# EAGLE design trig2_board (EAGLE 9.2.0)
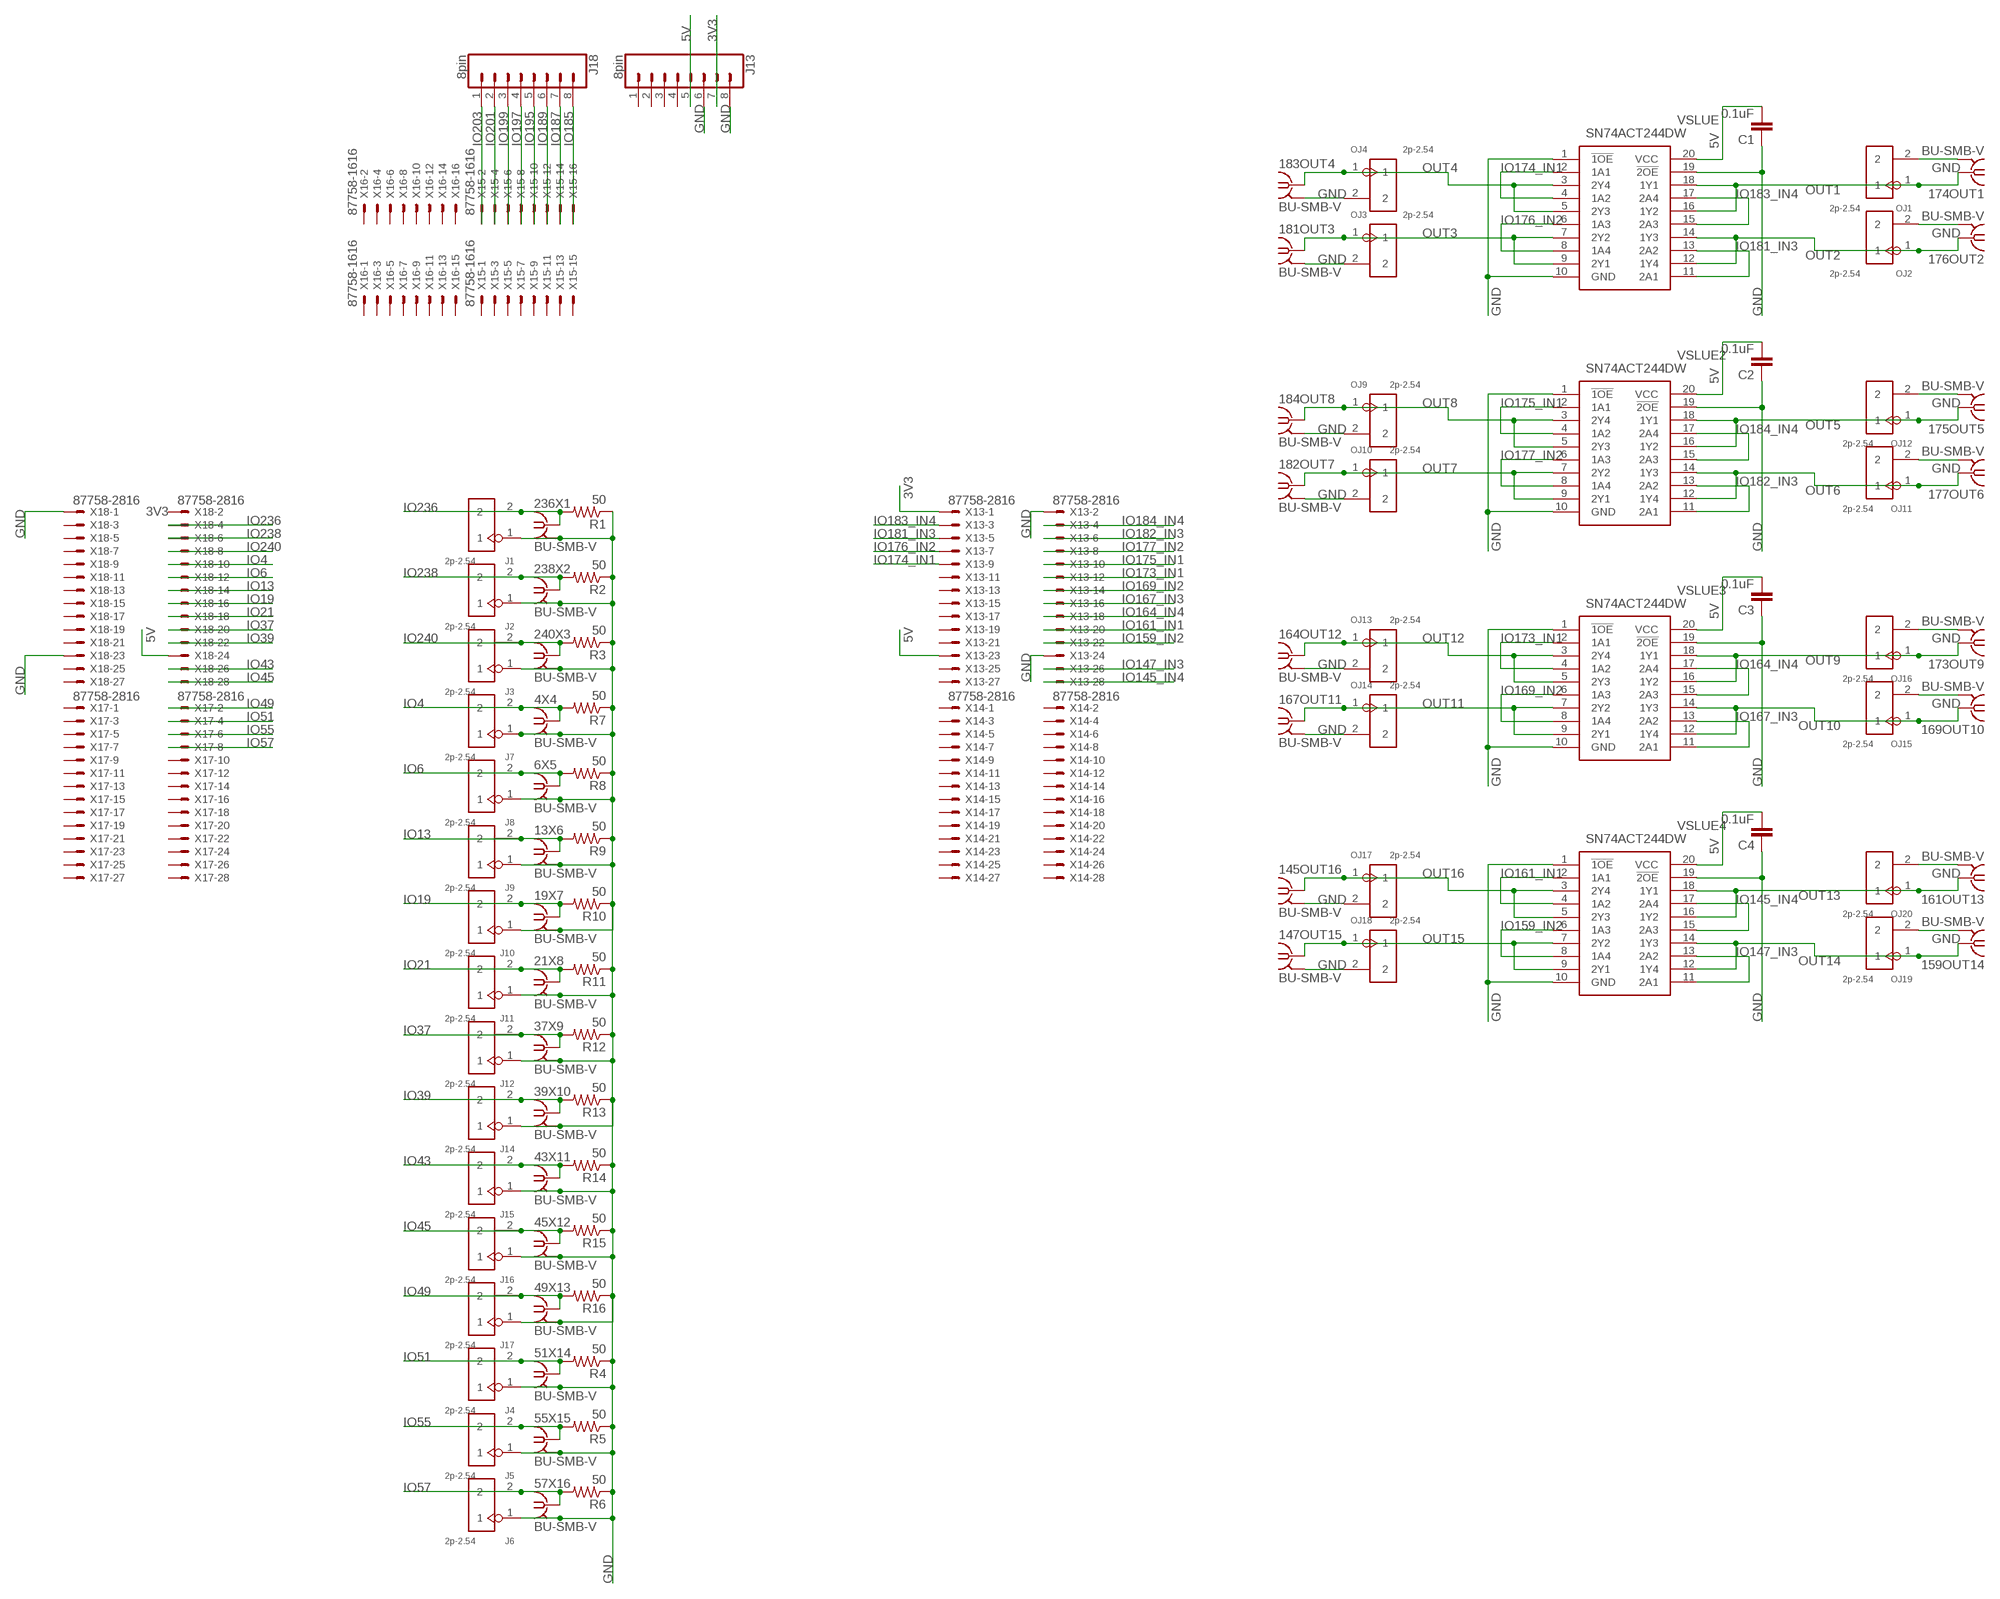
[diagram p0: schematic, sheet 1]

## Parts
4X4  BU-SMB-V  [BU-SMB-V]
6X5  BU-SMB-V  [BU-SMB-V]
13X6  BU-SMB-V  [BU-SMB-V]
19X7  BU-SMB-V  [BU-SMB-V]
21X8  BU-SMB-V  [BU-SMB-V]
37X9  BU-SMB-V  [BU-SMB-V]
39X10  BU-SMB-V  [BU-SMB-V]
43X11  BU-SMB-V  [BU-SMB-V]
45X12  BU-SMB-V  [BU-SMB-V]
49X13  BU-SMB-V  [BU-SMB-V]
51X14  BU-SMB-V  [BU-SMB-V]
55X15  BU-SMB-V  [BU-SMB-V]
57X16  BU-SMB-V  [BU-SMB-V]
145OUT16  BU-SMB-V  [BU-SMB-V]
147OUT15  BU-SMB-V  [BU-SMB-V]
159OUT14  BU-SMB-V  [BU-SMB-V]
161OUT13  BU-SMB-V  [BU-SMB-V]
164OUT12  BU-SMB-V  [BU-SMB-V]
167OUT11  BU-SMB-V  [BU-SMB-V]
169OUT10  BU-SMB-V  [BU-SMB-V]
173OUT9  BU-SMB-V  [BU-SMB-V]
174OUT1  BU-SMB-V  [BU-SMB-V]
175OUT5  BU-SMB-V  [BU-SMB-V]
176OUT2  BU-SMB-V  [BU-SMB-V]
177OUT6  BU-SMB-V  [BU-SMB-V]
181OUT3  BU-SMB-V  [BU-SMB-V]
182OUT7  BU-SMB-V  [BU-SMB-V]
183OUT4  BU-SMB-V  [BU-SMB-V]
184OUT8  BU-SMB-V  [BU-SMB-V]
236X1  BU-SMB-V  [BU-SMB-V]
238X2  BU-SMB-V  [BU-SMB-V]
240X3  BU-SMB-V  [BU-SMB-V]
C1  0.1uF  CAP0805  [0805]
C2  0.1uF  CAP0805  [0805]
C3  0.1uF  CAP0805  [0805]
C4  0.1uF  CAP0805  [0805]
J1  2p-2.54  DIP-BLACK-MALE-HEADER-VERT(2P-2.54)  [H2-2.54]
J2  2p-2.54  DIP-BLACK-MALE-HEADER-VERT(2P-2.54)  [H2-2.54]
J3  2p-2.54  DIP-BLACK-MALE-HEADER-VERT(2P-2.54)  [H2-2.54]
J4  2p-2.54  DIP-BLACK-MALE-HEADER-VERT(2P-2.54)  [H2-2.54]
J5  2p-2.54  DIP-BLACK-MALE-HEADER-VERT(2P-2.54)  [H2-2.54]
J6  2p-2.54  DIP-BLACK-MALE-HEADER-VERT(2P-2.54)  [H2-2.54]
J7  2p-2.54  DIP-BLACK-MALE-HEADER-VERT(2P-2.54)  [H2-2.54]
J8  2p-2.54  DIP-BLACK-MALE-HEADER-VERT(2P-2.54)  [H2-2.54]
J9  2p-2.54  DIP-BLACK-MALE-HEADER-VERT(2P-2.54)  [H2-2.54]
J10  2p-2.54  DIP-BLACK-MALE-HEADER-VERT(2P-2.54)  [H2-2.54]
J11  2p-2.54  DIP-BLACK-MALE-HEADER-VERT(2P-2.54)  [H2-2.54]
J12  2p-2.54  DIP-BLACK-MALE-HEADER-VERT(2P-2.54)  [H2-2.54]
J13  8pin  CONN_08"  [1X08]
J14  2p-2.54  DIP-BLACK-MALE-HEADER-VERT(2P-2.54)  [H2-2.54]
J15  2p-2.54  DIP-BLACK-MALE-HEADER-VERT(2P-2.54)  [H2-2.54]
J16  2p-2.54  DIP-BLACK-MALE-HEADER-VERT(2P-2.54)  [H2-2.54]
J17  2p-2.54  DIP-BLACK-MALE-HEADER-VERT(2P-2.54)  [H2-2.54]
J18  8pin  CONN_08"  [1X08]
OJ1  2p-2.54  DIP-BLACK-MALE-HEADER-VERT(2P-2.54)  [H2-2.54]
OJ2  2p-2.54  DIP-BLACK-MALE-HEADER-VERT(2P-2.54)  [H2-2.54]
OJ3  2p-2.54  DIP-BLACK-MALE-HEADER-VERT(2P-2.54)  [H2-2.54]
OJ4  2p-2.54  DIP-BLACK-MALE-HEADER-VERT(2P-2.54)  [H2-2.54]
OJ9  2p-2.54  DIP-BLACK-MALE-HEADER-VERT(2P-2.54)  [H2-2.54]
OJ10  2p-2.54  DIP-BLACK-MALE-HEADER-VERT(2P-2.54)  [H2-2.54]
OJ11  2p-2.54  DIP-BLACK-MALE-HEADER-VERT(2P-2.54)  [H2-2.54]
OJ12  2p-2.54  DIP-BLACK-MALE-HEADER-VERT(2P-2.54)  [H2-2.54]
OJ13  2p-2.54  DIP-BLACK-MALE-HEADER-VERT(2P-2.54)  [H2-2.54]
OJ14  2p-2.54  DIP-BLACK-MALE-HEADER-VERT(2P-2.54)  [H2-2.54]
OJ15  2p-2.54  DIP-BLACK-MALE-HEADER-VERT(2P-2.54)  [H2-2.54]
OJ16  2p-2.54  DIP-BLACK-MALE-HEADER-VERT(2P-2.54)  [H2-2.54]
OJ17  2p-2.54  DIP-BLACK-MALE-HEADER-VERT(2P-2.54)  [H2-2.54]
OJ18  2p-2.54  DIP-BLACK-MALE-HEADER-VERT(2P-2.54)  [H2-2.54]
OJ19  2p-2.54  DIP-BLACK-MALE-HEADER-VERT(2P-2.54)  [H2-2.54]
OJ20  2p-2.54  DIP-BLACK-MALE-HEADER-VERT(2P-2.54)  [H2-2.54]
R1  50  RESISTORAXIAL-0.3  [AXIAL-0.3]
R2  50  RESISTORAXIAL-0.3  [AXIAL-0.3]
R3  50  RESISTORAXIAL-0.3  [AXIAL-0.3]
R4  50  RESISTORAXIAL-0.3  [AXIAL-0.3]
R5  50  RESISTORAXIAL-0.3  [AXIAL-0.3]
R6  50  RESISTORAXIAL-0.3  [AXIAL-0.3]
R7  50  RESISTORAXIAL-0.3  [AXIAL-0.3]
R8  50  RESISTORAXIAL-0.3  [AXIAL-0.3]
R9  50  RESISTORAXIAL-0.3  [AXIAL-0.3]
R10  50  RESISTORAXIAL-0.3  [AXIAL-0.3]
R11  50  RESISTORAXIAL-0.3  [AXIAL-0.3]
R12  50  RESISTORAXIAL-0.3  [AXIAL-0.3]
R13  50  RESISTORAXIAL-0.3  [AXIAL-0.3]
R14  50  RESISTORAXIAL-0.3  [AXIAL-0.3]
R15  50  RESISTORAXIAL-0.3  [AXIAL-0.3]
R16  50  RESISTORAXIAL-0.3  [AXIAL-0.3]
VSLUE  SN74ACT244DW  [SOIC127P1030X265-20N]
VSLUE2  SN74ACT244DW  [SOIC127P1030X265-20N]
VSLUE3  SN74ACT244DW  [SOIC127P1030X265-20N]
VSLUE4  SN74ACT244DW  [SOIC127P1030X265-20N]
X13  87758-2816  [87758-2816]
X14  87758-2816  [87758-2816]
X15  87758-1616  [87758-1616]
X16  87758-1616  [87758-1616]
X17  87758-2816  [87758-2816]
X18  87758-2816  [87758-2816]

## Nets
3V3 [power]: J13.7 X13.1
5V [power]: C1.2 C2.2 C3.2 C4.2 J13.5 VSLUE2.20(VCC) VSLUE3.20(VCC) VSLUE4.20(VCC) VSLUE.20(VCC) X13.23 X18.24
GND: 4X4.2 4X4.3 4X4.4 4X4.5 6X5.2 6X5.3 6X5.4 6X5.5 13X6.2 13X6.3 13X6.4 13X6.5 19X7.2 19X7.3 19X7.4 19X7.5 21X8.2 21X8.3 21X8.4 21X8.5 37X9.2 37X9.3 37X9.4 37X9.5 39X10.2 39X10.3 39X10.4 39X10.5 43X11.2 43X11.3 43X11.4 43X11.5 45X12.2 45X12.3 45X12.4 45X12.5 49X13.2 49X13.3 49X13.4 49X13.5 51X14.2 51X14.3 51X14.4 51X14.5 55X15.2 55X15.3 55X15.4 55X15.5 57X16.2 57X16.3 57X16.4 57X16.5 145OUT16.2 145OUT16.3 145OUT16.4 145OUT16.5 147OUT15.2 147OUT15.3 147OUT15.4 147OUT15.5 159OUT14.2 159OUT14.3 159OUT14.4 159OUT14.5 161OUT13.2 161OUT13.3 161OUT13.4 161OUT13.5 164OUT12.2 164OUT12.3 164OUT12.4 164OUT12.5 167OUT11.2 167OUT11.3 167OUT11.4 167OUT11.5 169OUT10.2 169OUT10.3 169OUT10.4 169OUT10.5 173OUT9.2 173OUT9.3 173OUT9.4 173OUT9.5 174OUT1.2 174OUT1.3 174OUT1.4 174OUT1.5 175OUT5.2 175OUT5.3 175OUT5.4 175OUT5.5 176OUT2.2 176OUT2.3 176OUT2.4 176OUT2.5 177OUT6.2 177OUT6.3 177OUT6.4 177OUT6.5 181OUT3.2 181OUT3.3 181OUT3.4 181OUT3.5 182OUT7.2 182OUT7.3 182OUT7.4 182OUT7.5 183OUT4.2 183OUT4.3 183OUT4.4 183OUT4.5 184OUT8.2 184OUT8.3 184OUT8.4 184OUT8.5 236X1.2 236X1.3 236X1.4 236X1.5 238X2.2 238X2.3 238X2.4 238X2.5 240X3.2 240X3.3 240X3.4 240X3.5 C1.1 C2.1 C3.1 C4.1 J1.1 J2.1 J3.1 J4.1 J5.1 J6.1 J7.1 J8.1 J9.1 J10.1 J11.1 J12.1 J13.6 J13.8 J14.1 J15.1 J16.1 J17.1 OJ1.2 OJ2.2 OJ3.2 OJ4.2 OJ9.2 OJ10.2 OJ11.2 OJ12.2 OJ13.2 OJ14.2 OJ15.2 OJ16.2 OJ17.2 OJ18.2 OJ19.2 OJ20.2 R1.P$1 R2.P$1 R3.P$1 R4.P$1 R5.P$1 R6.P$1 R7.P$1 R8.P$1 R9.P$1 R10.P$1 R11.P$1 R12.P$1 R13.P$1 R14.P$1 R15.P$1 R16.P$1 VSLUE2.1(!1OE) VSLUE2.10(GND) VSLUE2.19(!2OE) VSLUE3.1(!1OE) VSLUE3.10(GND) VSLUE3.19(!2OE) VSLUE4.1(!1OE) VSLUE4.10(GND) VSLUE4.19(!2OE) VSLUE.1(!1OE) VSLUE.10(GND) VSLUE.19(!2OE) X13.2 X13.24 X18.1 X18.23
IO4: 4X4.1 J7.2 R7.P$2 X18.10
IO6: 6X5.1 J8.2 R8.P$2 X18.12
IO13: 13X6.1 J9.2 R9.P$2 X18.14
IO19: 19X7.1 J10.2 R10.P$2 X18.16
IO21: 21X8.1 J11.2 R11.P$2 X18.18
IO37: 37X9.1 J12.2 R12.P$2 X18.20
IO39: 39X10.1 J14.2 R13.P$2 X18.22
IO43: 43X11.1 J15.2 R14.P$2 X18.26
IO45: 45X12.1 J16.2 R15.P$2 X18.28
IO49: 49X13.1 J17.2 R16.P$2 X17.2
IO51: 51X14.1 J4.2 R4.P$2 X17.4
IO55: 55X15.1 J5.2 R5.P$2 X17.6
IO57: 57X16.1 J6.2 R6.P$2 X17.8
IO145_IN4: VSLUE4.15(2A3) VSLUE4.17(2A4) X13.28
IO147_IN3: VSLUE4.11(2A1) VSLUE4.13(2A2) X13.26
IO159_IN2: VSLUE4.6(1A3) VSLUE4.8(1A4) X13.22
IO161_IN1: VSLUE4.2(1A1) VSLUE4.4(1A2) X13.20
IO164_IN4: VSLUE3.15(2A3) VSLUE3.17(2A4) X13.18
IO167_IN3: VSLUE3.11(2A1) VSLUE3.13(2A2) X13.16
IO169_IN2: VSLUE3.6(1A3) VSLUE3.8(1A4) X13.14
IO173_IN1: VSLUE3.2(1A1) VSLUE3.4(1A2) X13.12
IO174_IN1: VSLUE.2(1A1) VSLUE.4(1A2) X13.9
IO175_IN1: VSLUE2.2(1A1) VSLUE2.4(1A2) X13.10
IO176_IN2: VSLUE.6(1A3) VSLUE.8(1A4) X13.7
IO177_IN2: VSLUE2.6(1A3) VSLUE2.8(1A4) X13.8
IO181_IN3: VSLUE.11(2A1) VSLUE.13(2A2) X13.5
IO182_IN3: VSLUE2.11(2A1) VSLUE2.13(2A2) X13.6
IO183_IN4: VSLUE.15(2A3) VSLUE.17(2A4) X13.3
IO184_IN4: VSLUE2.15(2A3) VSLUE2.17(2A4) X13.4
IO185: J18.8 X15.16
IO187: J18.7 X15.14
IO189: J18.6 X15.12
IO195: J18.5 X15.10
IO197: J18.4 X15.8
IO199: J18.3 X15.6
IO201: J18.2 X15.4
IO203: J18.1 X15.2
IO236: 236X1.1 J1.2 R1.P$2 X18.4
IO238: 238X2.1 J2.2 R2.P$2 X18.6
IO240: 240X3.1 J3.2 R3.P$2 X18.8
OUT1: 174OUT1.1 OJ1.1 VSLUE.16(1Y2) VSLUE.18(1Y1)
OUT2: 176OUT2.1 OJ2.1 VSLUE.12(1Y4) VSLUE.14(1Y3)
OUT3: 181OUT3.1 OJ3.1 VSLUE.7(2Y2) VSLUE.9(2Y1)
OUT4: 183OUT4.1 OJ4.1 VSLUE.3(2Y4) VSLUE.5(2Y3)
OUT5: 175OUT5.1 OJ12.1 VSLUE2.16(1Y2) VSLUE2.18(1Y1)
OUT6: 177OUT6.1 OJ11.1 VSLUE2.12(1Y4) VSLUE2.14(1Y3)
OUT7: 182OUT7.1 OJ10.1 VSLUE2.7(2Y2) VSLUE2.9(2Y1)
OUT8: 184OUT8.1 OJ9.1 VSLUE2.3(2Y4) VSLUE2.5(2Y3)
OUT9: 173OUT9.1 OJ16.1 VSLUE3.16(1Y2) VSLUE3.18(1Y1)
OUT10: 169OUT10.1 OJ15.1 VSLUE3.12(1Y4) VSLUE3.14(1Y3)
OUT11: 167OUT11.1 OJ14.1 VSLUE3.7(2Y2) VSLUE3.9(2Y1)
OUT12: 164OUT12.1 OJ13.1 VSLUE3.3(2Y4) VSLUE3.5(2Y3)
OUT13: 161OUT13.1 OJ20.1 VSLUE4.16(1Y2) VSLUE4.18(1Y1)
OUT14: 159OUT14.1 OJ19.1 VSLUE4.12(1Y4) VSLUE4.14(1Y3)
OUT15: 147OUT15.1 OJ18.1 VSLUE4.7(2Y2) VSLUE4.9(2Y1)
OUT16: 145OUT16.1 OJ17.1 VSLUE4.3(2Y4) VSLUE4.5(2Y3)
Unconnected: J13.1 J13.2 J13.3 J13.4 X13.11 X13.13 X13.15 X13.17 X13.19 X13.21 X13.25 X13.27 X14.1 X14.2 X14.3 X14.4 X14.5 X14.6 X14.7 X14.8 X14.9 X14.10 X14.11 X14.12 X14.13 X14.14 X14.15 X14.16 X14.17 X14.18 X14.19 X14.20 X14.21 X14.22 X14.23 X14.24 X14.25 X14.26 X14.27 X14.28 X15.1 X15.3 X15.5 X15.7 X15.9 X15.11 X15.13 X15.15 X16.1 X16.2 X16.3 X16.4 X16.5 X16.6 X16.7 X16.8 X16.9 X16.10 X16.11 X16.12 X16.13 X16.14 X16.15 X16.16 X17.1 X17.3 X17.5 X17.7 X17.9 X17.10 X17.11 X17.12 X17.13 X17.14 X17.15 X17.16 X17.17 X17.18 X17.19 X17.20 X17.21 X17.22 X17.23 X17.24 X17.25 X17.26 X17.27 X17.28 X18.2 X18.3 X18.5 X18.7 X18.9 X18.11 X18.13 X18.15 X18.17 X18.19 X18.21 X18.25 X18.27

## Notes on the sheet
- 3V3

## Library data of the parts
4X4 6X5 13X6 19X7 21X8 37X9 39X10 43X11 45X12 49X13 51X14 55X15 57X16 145OUT16 147OUT15 159OUT14 161OUT13 164OUT12 167OUT11 169OUT10 173OUT9 174OUT1 175OUT5 176OUT2 177OUT6 181OUT3 182OUT7 183OUT4 184OUT8 236X1 238X2 240X3 = con-coax:BU-SMB-V: FEMALE SMB CONNECTOR Radiall distributor RS 112-2993; OC_FARNELL: unknown; OC_NEWARK: unknown
C1-C4 = SparkFun-Capacitors:CAP: Capacitor Standard 0603 ceramic capacitor, and 0.1" leaded capacitor.
J1-J12 J14-J17 OJ1-OJ4 OJ9-OJ20 = Seeed-Connector:DIP-BLACK-MALE-HEADER-VERT(2P-2.54): 320020016; MPN: P125-1102A0BS116A1
J13 J18 = SparkFun-Connectors:CONN_08: Multi connection point. Often used as Generic Header-pin footprint for 0.1 inch spaced/style header connections On any of the 0.1 inch spaced packages, you can populate with these: Break Away Headers - Straight <https://www.sparkfun.com/products/116> (PRT-00116) Break Away Male Headers - Right Angle <https://www.sparkfun.com/products/553> (PRT-00553) Female Headers <https://www.sparkfun.com/products/115> (PRT-00115) Break Away Headers - Machine Pin <https://www.sparkfun.com/products/117> (PRT-00117) Break Away Female Headers - Swiss Machine Pin <https://www.sparkfun.com/products/743> (PRT-00743) Arduino Stackable Header - 8 Pin <https://www.sparkfun.com/products/9279> (PRT-09279) For SCREWTERMINALS and SPRING TERMINALS visit here: Screw Terimnals on SparkFun.com <https://www.sparkfun.com/search/results?term=Screw+Terminals> (5mm/3.5mm/2.54mm spacing) This device is also useful as a general connection point to wire up your design to another part of your project. Our various solder wires solder well into these plated through hole pads. Hook-Up Wire - Assortment (Stranded, 22 AWG) <https://www.sparkfun.com/products/11375> (PRT-11375) Hook-Up Wire - Assortment (Solid Core, 22 AWG) <https://www.sparkfun.com/products/11367> (PRT-11367) View the entire wire category on our website here <https://www.sparkfun.com/categories/141> Special notes: Molex polarized connector foot print use with SKU : PRT-08231 with associated crimp pins and housings. 1MM SMD Version SKU: PRT-10208 NOTES ON THE VARIANTS LOCK and LOCK_LONGPADS... This footprint was designed to help hold the alignment of a through-hole component (i.e. 6-pin header) while soldering it into place. You may notice that each hole has been shifted either up or down by 0.005 of an inch from it's more standard position (which is a perfectly straight line). This slight alteration caused the pins (the squares in the middle) to touch the edges of the holes. Because they are alternating, it causes a "brace" to hold the component in place. 0.005 has proven to be the perfect amount of "off-center" position when using our standard breakaway headers. Although looks a little odd when you look at the bare footprint, once you have a header in there, the alteration is very hard to notice. Also,if you push a header all the way into place, it is covered up entirely on the bottom side.; PROD_ID: CONN-08438
R1-R16 = SparkFun-Passives:RESISTOR: Resistor Basic schematic elements and footprints for 0603, 1206, and PTH resistors.
VSLUE VSLUE2-VSLUE4 = SN74ACT244DW:SN74ACT244DW: SN74ACT244DW, 8-Bit Buffer, Line Driver, ACT, 3-State Non-Inverting 4.5 5.5 V 20-Pin SOIC Source: Datasheet <http://www.ti.com/lit/ds/symlink/sn74act244.pdf>; ARROW_PART_NUMBER: SN74ACT244DW; ARROW_PRICE-STOCK: https://www.arrow.com/en/products/sn74act244dw/texas-instruments; DESCRIPTION: SN74ACT244DW, 8-Bit Buffer, Line Driver, ACT, 3-State Non-Inverting 4.5 5.5 V 20-Pin SOIC; HEIGHT: 2.65mm; MANUFACTURER_NAME: Texas Instruments; MANUFACTURER_PART_NUMBER: SN74ACT244DW; RS_PART_NUMBER: 4363169; RS_PRICE-STOCK: http://uk.rs-online.com/web/p/products/4363169
X13 X14 X17 X18 = con-molex:87758-2816: 28 Pin - 2mm Dual Row Single Wafer, Vertical T/H HDR Source: http://www.molex.com/pdm_docs/sd/877580616_sd.pdf; MF: MOLEX; MPN: 87758-2816; OC_FARNELL: unknown; OC_NEWARK: 25M5681
X15 X16 = con-molex:87758-1616: 16 Pin - 2mm Dual Row Single Wafer, Vertical T/H HDR Source: http://www.molex.com/pdm_docs/sd/877580616_sd.pdf; MF: MOLEX; MPN: 87758-1616; OC_FARNELL: 7472366; OC_NEWARK: 59J1563

## Net classes
0 default: width 0.254 mm
1 power: width 0.762 mm

## Board
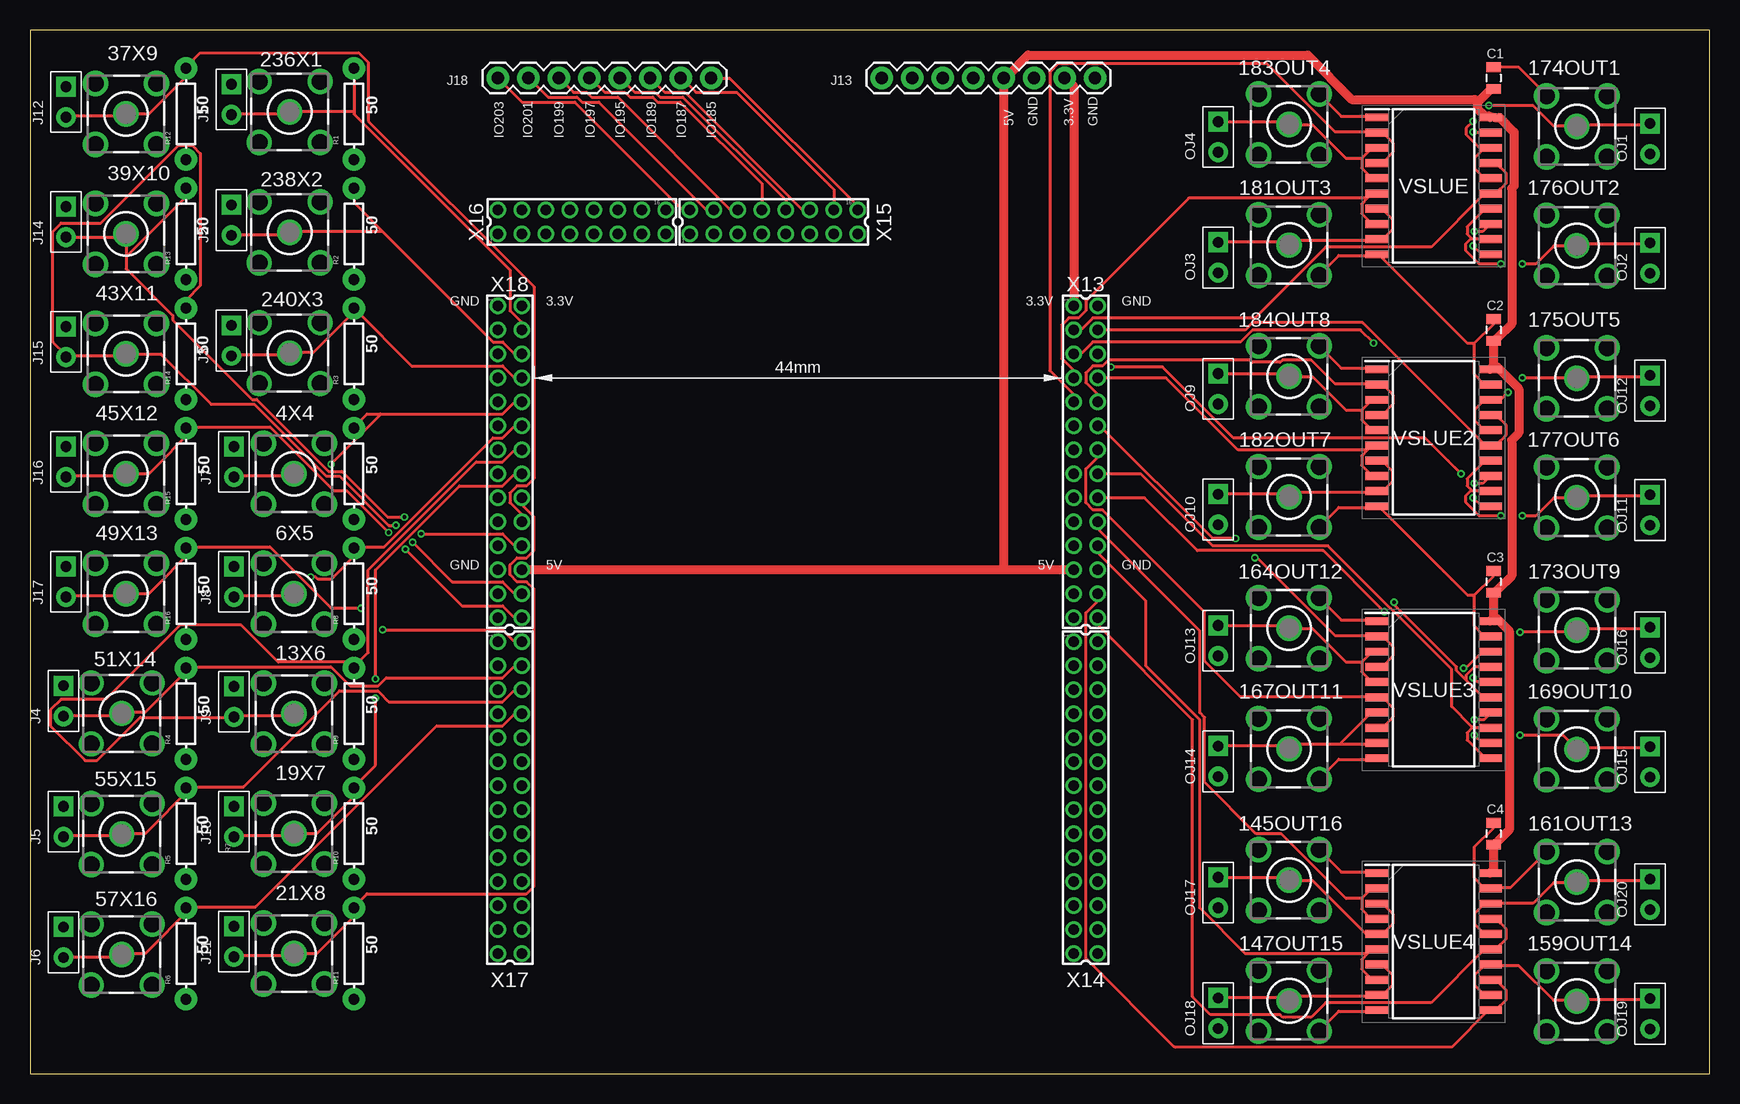
[diagram p1: board, top side]
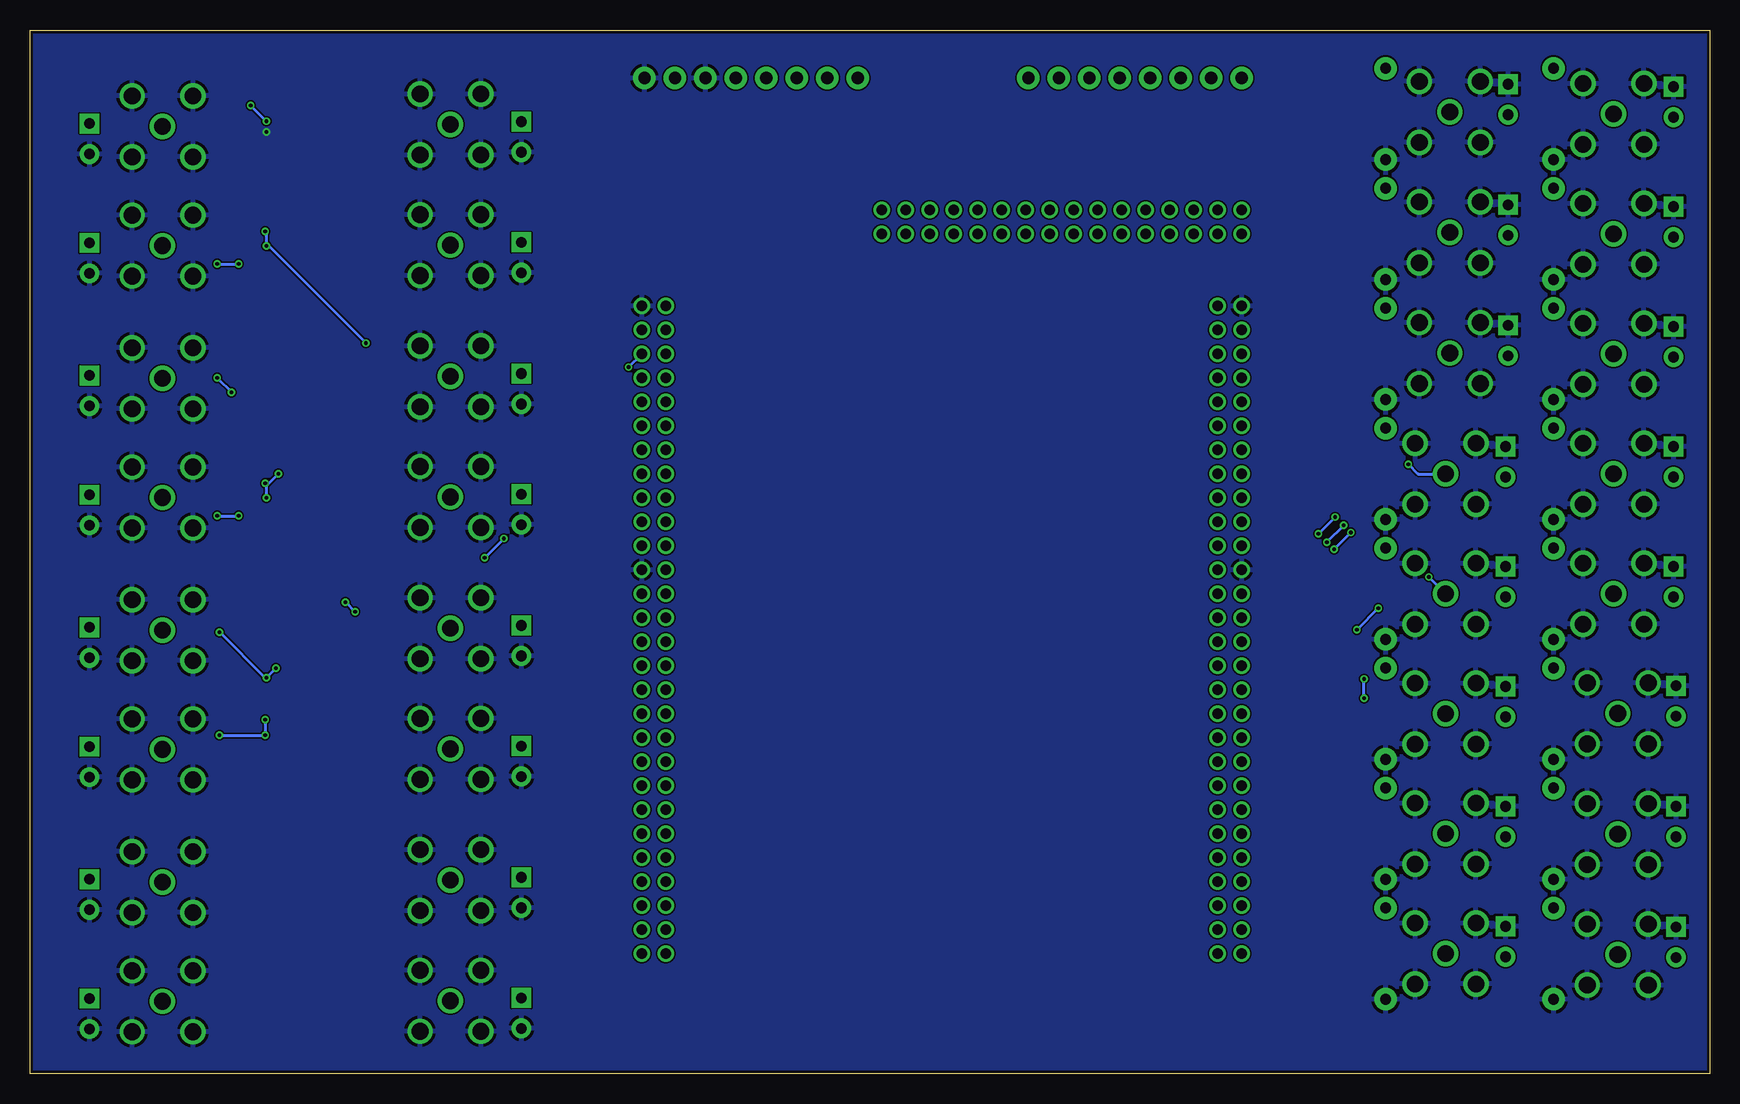
[diagram p2: board, bottom side, seen from below]

Size 140 x 87 mm. Coordinates in mm from the lower left corner, seen from the top.
Outline: 0,87 0,0 140,0 140,87 0,87
Copper layers (1*16): Top 0.035mm / dielectric 1.5mm / Bottom 0.035mm
Design rules "MF_Standard_2_Layer": minimum track width 5mil, minimum drill 12mil, track to track 5mil, track to pad 5mil, pad to pad 5mil, via to via 5mil, smd to smd 0mil, copper to edge 10mil, drill to drill 10mil, minimum pad ring 6mil, minimum via ring 6mil, stop-mask expansion 2mil, vias tented up to drill 25mil, thermal gap 10mil

### Footprints (pad centres in the part's own frame; a part is rotated, then mirrored left to right if it is on the bottom)
BU-SMB-V = drill 1.4: 1 0,0; 2 -2.54,2.54; 3 2.54,2.54; 4 2.54,-2.54; 5 -2.54,-2.54
0805 = smd 0.8 x 1.2: 1 -0.9,0; 2 0.9,0
H2-2.54 = drill 0.889 pad 1.651 square: 1 0,1.27 | drill 0.889 pad 1.651: 2 0,-1.27
1X08 = drill 1.016 pad 1.88: 1 0,0; 2 2.54,0; 3 5.08,0; 4 7.62,0; 5 10.16,0; 6 12.7,0; 7 15.24,0; 8 17.78,0
AXIAL-0.3 = drill 0.9 pad 1.88: P$1 -3.81,0; P$2 3.81,0
SOIC127P1030X265-20N = smd 1.95 x 0.65: 1 -4.725,5.715; 2 -4.725,4.445; 3 -4.725,3.175; 4 -4.725,1.905; 5 -4.725,0.635; 6 -4.725,-0.635; 7 -4.725,-1.905; 8 -4.725,-3.175; 9 -4.725,-4.445; 10 -4.725,-5.715; 11 4.725,-5.715; 12 4.725,-4.445; 13 4.725,-3.175; 14 4.725,-1.905; 15 4.725,-0.635; 16 4.725,0.635; 17 4.725,1.905; 18 4.725,3.175; 19 4.725,4.445; 20 4.725,5.715
87758-2816 = drill 0.9 pad 1.27: 1 -13,-1; 2 -13,1; 3 -11,-1; 4 -11,1; 5 -9,-1; 6 -9,1; 7 -7,-1; 8 -7,1; 9 -5,-1; 10 -5,1; 11 -3,-1; 12 -3,1; 13 -1,-1; 14 -1,1; 15 1,-1; 16 1,1; 17 3,-1; 18 3,1; 19 5,-1; 20 5,1; 21 7,-1; 22 7,1; 23 9,-1; 24 9,1; 25 11,-1; 26 11,1; 27 13,-1; 28 13,1
87758-1616 = drill 0.9 pad 1.27: 1 -7,-1; 2 -7,1; 3 -5,-1; 4 -5,1; 5 -3,-1; 6 -3,1; 7 -1,-1; 8 -1,1; 9 1,-1; 10 1,1; 11 3,-1; 12 3,1; 13 5,-1; 14 5,1; 15 7,-1; 16 7,1

### Placement (x,y rotation side)
4X4  22,50 0 top
6X5  22,40 0 top
13X6  22,30 0 top
19X7  22,20 0 top
21X8  22,10 0 top
37X9  8,80 0 top
39X10  8,70 0 top
43X11  8,60 0 top
45X12  8,50 0 top
49X13  8,40 0 top
51X14  7.65,30.02 90 top
55X15  7.65,19.96 90 top
57X16  7.65,9.91 90 top
145OUT16  104.95,16.12 90 top
147OUT15  104.95,6.07 90 top
159OUT14  128.95,6.02 90 top
161OUT13  128.95,15.96 90 top
164OUT12  104.95,37.12 90 top
167OUT11  104.95,27.07 90 top
169OUT10  128.95,27.02 90 top
173OUT9  128.95,36.96 90 top
174OUT1  128.95,78.96 90 top
175OUT5  128.95,57.96 90 top
176OUT2  128.95,69.02 90 top
177OUT6  128.95,48.02 90 top
181OUT3  104.95,69.07 90 top
182OUT7  104.95,48.07 90 top
183OUT4  104.95,79.12 90 top
184OUT8  104.95,58.12 90 top
236X1  21.65,80.17 90 top
238X2  21.65,70.12 90 top
240X3  21.65,60.07 90 top
C1  122,83 270 top
C2  122,62 270 top
C3  122,41 270 top
C4  122,20 270 top
J1  16.79,81.21 0 top
J2  16.79,71.16 0 top
J3  16.79,61.11 0 top
J4  2.79,31.05 0 top
J5  2.79,21 0 top
J6  2.79,10.95 0 top
J7  17,51 0 top
J8  17,41 0 top
J9  17,31 0 top
J10  17,21 0 top
J11  17,11 0 top
J12  3,81 0 top
J13  71,83 0 top
J14  3,71 0 top
J15  3,61 0 top
J16  3,51 0 top
J17  3,41 0 top
J18  39,83 0 top
OJ1  135.04,77.93 0 top
OJ2  135.04,67.98 0 top
OJ3  99.04,68.03 0 top
OJ4  99.04,78.08 0 top
OJ9  99.04,57.08 0 top
OJ10  99.04,47.03 0 top
OJ11  135.04,46.98 0 top
OJ12  135.04,56.93 0 top
OJ13  99.04,36.08 0 top
OJ14  99.04,26.03 0 top
OJ15  135.04,25.98 0 top
OJ16  135.04,35.93 0 top
OJ17  99.04,15.08 0 top
OJ18  99.04,5.03 0 top
OJ19  135.04,4.98 0 top
OJ20  135.04,14.93 0 top
R1  27,80 90 top
R2  27,70 90 top
R3  27,60 90 top
R4  13,30 90 top
R5  13,20 90 top
R6  13,10 90 top
R7  27,50 90 top
R8  27,40 90 top
R9  27,30 90 top
R10  27,20 90 top
R11  27,10 90 top
R12  13,80 90 top
R13  13,70 90 top
R14  13,60 90 top
R15  13,50 90 top
R16  13,40 90 top
VSLUE  117,74 0 top
VSLUE2  117,53 0 top
VSLUE3  117,32 0 top
VSLUE4  117,11 0 top
X13  88,51 270 top
X14  88,23 270 top
X15  62,71 0 top
X16  46,71 0 top
X17  40,23 270 top
X18  40,51 270 top

### Tracks (layer width: path | path; a pad name or v marks a point on that pad's centre or on a via)
3V3
  Top 0.762: X13.1 87,82.3 86.3,83 J13.7
5V
  Top 0.762: VSLUE4.20 121.8,16.8 122,17 C4.2 122.3,19.3 123.3,20.3 123.3,36.9 122.3,37.9 VSLUE3.20 121.8,37.8 122,38 C3.2 122.3,40.3 123.5,41.5 123.5,52.8 124.1,53.4 124.1,57.1 122.3,58.9 VSLUE2.20 121.8,58.8 122,59 C2.2 122.3,61.3 123.5,62.5 123.5,73.8 123.7,74 123.7,78.5 122.5,79.7 122.1,79.7 VSLUE.20 121.7,79.8 121.3,79.8 120.7,80.4 120.7,81 | C1.2 121.8,82.1 120.7,81 | X13.23 81.2,42 | 81.2,42 X18.24 | 81.2,42 81.2,83 J13.5 81.5,83.2 83.2,84.9 106.5,84.9 110.2,81.2 120.4,81.2 120.7,81
GND  (via drill 0.3)
  Top 0.254: C2.1 122,62.5 120.4,60.9 | 120.4,60.9 120.4,58.3 121.2,57.5 121.7,57.5 VSLUE2.19 | C3.1 122,41.5 120.4,39.9 | 120.4,39.9 120.4,37.3 121.2,36.5 121.7,36.5 VSLUE3.19 | C4.1 122,20.5 120.4,18.9 120.4,16.3 121.2,15.5 121.7,15.5 VSLUE4.19 121.8,15.5 123.4,15.5 161OUT13.3 | C1.1 124.1,83.9 126.4,81.6 174OUT1.3 | VSLUE4.10 112.2,5.2 109.1,5.2 107.5,3.6 147OUT15.5 | VSLUE4.1 112.2,16.8 109.3,16.8 107.5,18.6 145OUT16.4 | VSLUE3.10 112.2,26.2 109.1,26.2 107.5,24.6 167OUT11.5 | VSLUE3.1 112.2,37.8 109.3,37.8 107.5,39.6 164OUT12.4 | 182OUT7.5 107.5,45.6 109.1,47.2 112.2,47.2 VSLUE2.10 112.4,47.3 119.8,39.9 120.4,39.9 | VSLUE2.1 112.2,58.8 109.3,58.8 107.5,60.6 184OUT8.4 | 181OUT3.5 107.5,66.6 109.1,68.2 112.2,68.2 VSLUE.10 112.4,68.3 119.8,60.9 120.4,60.9 | VSLUE.1 112.2,79.8 109.3,79.8 107.5,81.6 183OUT4.4 | v120.3,78.5 121.7,78.5 VSLUE.19
  pour Bottom: 141,88 141,-1 -1,-1 -1,88
IO4  (via drill 0.3)
  Top 0.254: 4X4.1 21.8,49.8 17,49.8 J7.2 | X18.10 40.4,56 39.4,55 29.2,55 | 29.2,55 28.1,55 27,53.9 R7.P$2 | v25.1,50.8 29.2,54.9 29.2,55
  Bottom 0.254: 4X4.1 24.3,50 v25.1,50.8
IO6  (via drill 0.3)
  Top 0.254: 6X5.1 21.8,39.8 17,39.8 J8.2 | X18.12 40.4,54 39.4,53 38.6,53 29.5,43.9 27,43.9 R8.P$2 27.7,43.8 25.1,41.2 24,41.2 23.8,41.4 v23.4,41.4
  Bottom 0.254: v23.4,41.4 6X5.1
IO13
  Top 0.254: 13X6.1 21.8,29.8 17,29.8 J9.2 16.9,29.7 9.2,29.7 5.6,26.1 4.6,26.1 1.7,29 1.7,30.3 2.6,31.2 6.3,31.2 12.5,37.4 17.6,37.4 20.7,34.3 27.3,34.3 R9.P$2 27,33.9 28.2,35.1 28.2,42 37.2,51 39.4,51 40.4,52 X18.14
IO19  (via drill 0.3)
  Top 0.254: J10.2 17,19.8 21.8,19.8 19X7.1 23.9,20 27,23.1 R10.P$2 27,23.9 28.8,25.7 v28.8,31.3 | X18.16 40.4,50 39.4,49 35.8,49 28.8,42 v28.8,32.9
  Bottom 0.254: v28.8,31.3 v28.8,32.9
IO21
  Top 0.254: J11.2 17,9.8 21.8,9.8 21X8.1 23.9,10 27,13.1 R11.P$2 27,13.9 28.1,15 41.4,15 42,15.6 42,40.4 41.4,41 40.6,41 40,41.6 40,42.4 40.6,43 41.4,43 42,43.6 42,46.4 41,47.4 X18.18
IO37
  Top 0.254: J12.2 3,79.8 7.8,79.8 37X9.1 9.9,80 13,83.1 R12.P$2 13,83.9 14.2,85.1 27.4,85.1 28.2,84.3 28.2,79.4 42,65.6 42,49.6 41.4,49 40.6,49 40,48.4 40,47.6 41,46.6 X18.20
IO39  (via drill 0.3)
  Top 0.254: X18.22 40.4,44 39.4,45 v32.6,45 | v31.2,46.4 29.8,46.4 26,50.2 24.9,50.2 18.9,56.2 18.5,56.2 11.9,62.8 11.9,63.2 8,67.1 8,68.2 | 8,68.2 39X10.1 7.9,69.7 3,69.7 J14.2 | R13.P$2 13,73.1 8.1,68.2 8,68.2
  Bottom 0.254: v31.2,46.4 v32.6,45
IO43  (via drill 0.3)
  Top 0.254: X18.26 40.4,40 39.4,41 35.2,41 v31.9,44.3 | v30.5,45.7 29.9,45.7 25.8,49.8 24.7,49.8 18.7,55.8 15.1,55.8 10.9,60 43X11.1 7.9,60 7.7,59.8 3,59.8 J15.2 3,59.9 1.9,61 1.9,70.2 2.6,70.9 5.9,70.9 12.4,77.4 13.5,77.4 14.2,76.7 14.2,65.7 13,64.5 R14.P$2
  Bottom 0.254: v30.5,45.7 v31.9,44.3
IO45  (via drill 0.3)
  Top 0.254: J16.2 3,49.8 7.8,49.8 45X12.1 9.9,50 13.7,53.8 R15.P$2 13,53.9 20,53.9 25.3,48.6 26.4,48.6 v29.9,45.1 | X18.28 40.4,38 39.4,39 36,39 v31.3,43.7
  Bottom 0.254: v29.9,45.1 v31.3,43.7
IO49  (via drill 0.3)
  Top 0.254: J17.2 3,39.8 7.8,39.8 49X13.1 9.9,40 13.7,43.8 R16.P$2 13,43.9 20,43.9 25.1,38.8 v27.6,38.8 | X17.2 40.4,36 39.4,37 v29.4,37
  Bottom 0.254: v27.6,38.8 v29.4,37
IO51
  Top 0.254: J4.2 2.8,29.8 7.4,29.8 7.6,30 51X14.1 7.7,30.1 9.6,30.1 13.3,33.8 R4.P$2 13,33.9 25.1,33.9 26.7,32.3 29,32.3 29.7,33 39.4,33 40.4,34 X17.4
IO55
  Top 0.254: J5.2 2.8,19.8 7.5,19.8 7.6,19.9 55X15.1 7.7,20 9.6,20 13.4,23.8 R5.P$2 13,23.9 17.8,23.9 25.8,31.9 29,31.9 29.9,31 39.4,31 40.4,32 X17.6
IO57
  Top 0.254: J6.2 2.8,9.7 7.4,9.7 7.6,9.9 57X16.1 7.7,10 9.6,10 13.4,13.8 R6.P$2 13,13.9 18.8,13.9 33.9,29 39.4,29 40.4,30 X17.8
IO145_IN4
  Top 0.254: VSLUE4.17 121.8,12.9 122.2,12.9 123,12.1 123,11.2 122.2,10.4 121.8,10.4 VSLUE4.15 121.7,10.3 121.2,10.3 116.8,5.9 108,5.9 106.8,4.7 104.4,4.7 104.2,4.9 98.4,4.9 96.9,6.4 96.9,29.5 89,37.4 X13.28
IO147_IN3
  Top 0.254: VSLUE4.13 121.8,7.8 122.2,7.8 123,7 123,6.1 122.2,5.3 121.8,5.3 VSLUE4.11 121.6,5.3 118.5,2.2 95.4,2.2 88,9.6 88,38.4 89,39.4 X13.26
IO159_IN2
  Top 0.254: 111.45,9.95 111.8,10.3 112.2,10.3 VSLUE4.6 | 111.45,9.95 111,9.5 111,8.7 111.8,7.9 112.2,7.9 VSLUE4.8 | X13.22 89,43.4 93,39.4 93,34 97.5,29.5 97.5,13.8 101.3,10 111.4,10 111.45,9.95
IO161_IN1
  Top 0.254: 111,14.6 111,13.7 111.7,13 112.2,13 VSLUE4.4 | 111,14.6 111.8,15.4 112.2,15.4 VSLUE4.2 | X13.20 89,45.4 97.5,36.9 97.5,30.1 97.9,29.7 97.9,24.3 102.2,20 104.3,20 109.7,14.6 111,14.6
IO164_IN4  (via drill 0.3)
  Top 0.254: 119.7,32.9 119.7,33.2 120.4,33.9 121.7,33.9 VSLUE3.17 | 119.7,32.9 119.7,32.8 121.1,31.4 121.7,31.4 VSLUE3.15 | X13.18 92.9,48 97.3,43.6 107.8,43.6 v112.9,38.5 | v113.7,39.3 113.7,39.1 118.9,33.9 118.9,33.6 119.6,32.9 119.7,32.9
  Bottom 0.254: v113.7,39.3 v112.9,38.5
IO167_IN3
  Top 0.254: 120.2,28.8 119.8,28.4 119.8,27.8 121.3,26.3 121.7,26.3 VSLUE3.11 | 120.2,28.8 121.7,28.8 VSLUE3.13 | X13.16 92.6,50 98.6,44 108.2,44 118.5,33.7 118.5,30.6 120.2,28.9 120.2,28.8
IO169_IN2
  Top 0.254: VSLUE3.8 112.3,28.9 112.8,28.9 113.6,29.7 113.6,30.5 112.8,31.3 112.3,31.3 VSLUE3.6 112.2,31.4 100.9,31.4 97.9,34.4 97.9,38.5 89.4,47 88.6,47 88,47.6 88,50.4 89,51.4 X13.14
IO173_IN1  (via drill 0.3)
  Top 0.254: VSLUE3.4 112.3,34 112.8,34 113.6,34.8 113.6,35.6 112.8,36.4 112.3,36.4 VSLUE3.2 112.2,36.5 108.8,36.5 102.3,43 v102.1,43 | X13.12 89.2,54 98.6,44.6 v100.5,44.6
  Bottom 0.254: v102.1,43 v100.5,44.6
IO174_IN1
  Top 0.254: VSLUE.4 112.3,76 112.8,76 113.6,76.8 113.6,77.6 112.8,78.4 112.3,78.4 VSLUE.2 112.2,78.5 108.8,78.5 103.1,84.2 85.7,84.2 85,83.5 85,58.6 87,56.6 X13.9
IO175_IN1
  Top 0.254: VSLUE2.4 112.3,55 112.8,55 113.6,55.8 113.6,56.6 112.8,57.4 112.3,57.4 VSLUE2.2 112.2,57.5 108.8,57.5 106.8,59.5 104.4,59.5 104.2,59.3 101.9,59.3 101.7,59.5 89.9,59.5 89.4,59 88.6,59 88,58.4 88,57.6 89,56.6 X13.10
IO176_IN2
  Top 0.254: 111.45,72.95 111.8,73.3 112.2,73.3 VSLUE.6 | 111.45,72.95 111,72.5 111,71.7 111.8,70.9 112.2,70.9 VSLUE.8 | X13.7 87,58.6 86,59.6 86,62.4 86.6,63 87.4,63 88,63.6 88,64.4 96.6,73 111.4,73 111.45,72.95
IO177_IN2
  Top 0.254: 111.45,51.95 111.8,52.3 112.2,52.3 VSLUE2.6 | 111.45,51.95 111,51.5 111,50.7 111.8,49.9 112.2,49.9 VSLUE2.8 | X13.8 94.7,58 100.7,52 111.4,52 111.45,51.95
IO181_IN3  (via drill 0.3)
  Top 0.254: v120.3,69 121,68.3 121.7,68.3 VSLUE.11 | v120.4,70.2 121.1,70.2 VSLUE.13 | X13.5 87.6,60 88.6,61 100.9,61 101.9,62 110.9,62 v112,60.9
  Bottom 0.254: v120.4,70.2 120.3,70.1 v120.3,69 120.2,69.1 v112,60.9
IO182_IN3  (via drill 0.3)
  Top 0.254: v120.3,48 121,47.3 121.7,47.3 VSLUE2.11 | v120.4,49.2 121.1,49.2 VSLUE2.13 | v90.1,58.9 94.4,58.9 100.3,53 116.3,53 v119.3,50
  Bottom 0.254: v120.3,48 120.3,49.1 v120.4,49.2 120.2,49.1 v119.3,50 | v90.1,58.9 X13.6
IO183_IN4
  Top 0.254: VSLUE.17 121.8,75.9 122.2,75.9 123,75.1 123,74.2 122.2,73.4 121.8,73.4 VSLUE.15 121.7,73.3 121.2,73.3 116.8,68.9 108,68.9 102.1,63 88.6,63 87.6,62 X13.3
IO184_IN4
  Top 0.254: VSLUE2.17 121.8,54.9 122.2,54.9 123,54.1 123,53.2 122.2,52.4 121.8,52.4 VSLUE2.15 121.7,52.4 121.3,52.4 111.1,62.6 101.9,62.6 101.3,62 X13.4
IO185
  Top 0.254: X15.16 69,72.3 58.3,83 J18.8
IO187
  Top 0.254: X15.14 67,73.7 58.9,81.8 55.5,81.8 54.3,83 J18.7
IO189
  Top 0.254: X15.12 64.4,72 54.6,81.8 52.9,81.8 J18.6
IO195
  Top 0.254: X15.10 63,72.8 54.4,81.4 52.5,81.4 52.1,81.8 50.4,81.8 49.2,83 J18.5
IO197
  Top 0.254: X15.8 61,74.2 54.2,81 52.3,81 51.9,81.4 50,81.4 49.6,81.8 47.9,81.8 46.7,83 J18.4
IO199
  Top 0.254: X15.6 58.4,72 49,81.4 46.8,81.4 46.4,81.8 45.3,81.8 44.1,83 J18.3
IO201
  Top 0.254: X15.4 56.4,72 47.4,81 46,81 45.6,81.4 43.2,81.4 41.6,83 J18.2
IO203
  Top 0.254: X15.2 54.4,72 45.4,81 41,81 J18.1
IO236
  Top 0.254: J1.2 16.8,80 21.5,80 21.6,80.1 236X1.1 21.7,80.2 27,80.2 | X18.4 41,62.6 40,63.6 40,67 27,80 27,80.2 | R1.P$2 27,80.2
IO238
  Top 0.254: J2.2 21.4,69.9 21.6,70.1 238X2.1 21.7,70.2 29.3,70.2 29.35,70.25 | X18.6 40.4,60 39.4,61 38.6,61 29.35,70.25 | 29.35,70.25 27,72.6 R2.P$2
IO240
  Top 0.254: J3.2 16.8,59.9 21.5,59.9 21.6,60 240X3.1 21.7,60.1 23.6,60.1 27.1,63.6 R3.P$2 31.8,59 39.4,59 40.4,58 X18.8
OUT1  (via drill 0.3)
  Top 0.254: VSLUE.16 121.7,74.7 121.2,74.7 120.4,75.5 120.4,76.3 121.2,77.1 121.7,77.1 VSLUE.18 121,77 119.7,78.3 119.7,78.8 v120.3,79.4 | v121.6,80.7 125.3,80.7 127,79 128.9,79 174OUT1.1 128.9,79.1 135,79.1 OJ1.1
  Bottom 0.254: v121.6,80.7 v120.3,79.4
OUT2  (via drill 0.3)
  Top 0.254: 120.2,69.6 121.7,69.6 VSLUE.12 | 120.2,69.6 119.8,70 119.8,70.6 121.2,72 121.7,72 VSLUE.14 | v122.6,67.5 120.8,67.5 119.7,68.6 119.7,69.2 120.1,69.6 120.2,69.6 | v124.4,67.5 125.5,67.5 127,69 128.9,69 176OUT2.1 129,69.1 129.1,69.2 135,69.2 OJ2.1
  Bottom 0.254: v124.4,67.5 v122.6,67.5
OUT3
  Top 0.254: VSLUE.7 112.3,72 112.8,72 113.6,71.2 113.6,70.4 112.8,69.6 112.3,69.6 VSLUE.9 112.2,69.5 105.4,69.5 105,69.1 181OUT3.1 105.1,69.3 99.1,69.3 OJ3.1
OUT4
  Top 0.254: 111,76.3 111,75.5 111.8,74.7 112.2,74.7 VSLUE.5 | 111,76.3 111.8,77.1 112.2,77.1 VSLUE.3 | 111,76.3 109.7,76.3 106.9,79.1 105,79.1 183OUT4.1 104.9,79.2 104.8,79.3 99.1,79.3 OJ4.1
OUT5  (via drill 0.3)
  Top 0.254: VSLUE2.16 121.7,53.7 121.2,53.7 120.4,54.5 120.4,55.3 121.2,56.1 121.7,56.1 VSLUE2.18 121.8,56.2 122.6,56.2 v123.2,56.8 | v124.4,58 128.9,58 175OUT5.1 128.9,58.1 135,58.1 OJ12.1
  Bottom 0.254: v124.4,58 v123.2,56.8
OUT6  (via drill 0.3)
  Top 0.254: 120.2,48.6 121.7,48.6 VSLUE2.12 | 120.2,48.6 119.8,49 119.8,49.6 121.2,51 121.7,51 VSLUE2.14 | v122.6,46.5 120.8,46.5 119.7,47.6 119.7,48.2 120.1,48.6 120.2,48.6 | v124.4,46.5 125.5,46.5 127,48 128.9,48 177OUT6.1 129,48.1 129.1,48.2 135,48.2 OJ11.1
  Bottom 0.254: v124.4,46.5 v122.6,46.5
OUT7
  Top 0.254: VSLUE2.7 112.3,51 112.8,51 113.6,50.2 113.6,49.4 112.8,48.6 112.3,48.6 VSLUE2.9 112.2,48.5 105.4,48.5 105,48.1 182OUT7.1 105.1,48.3 99.1,48.3 OJ10.1
OUT8
  Top 0.254: 111,55.3 111,54.5 111.8,53.7 112.2,53.7 VSLUE2.5 | 111,55.3 111.8,56.1 112.2,56.1 VSLUE2.3 | 111,55.3 109.7,55.3 106.9,58.1 105,58.1 184OUT8.1 104.9,58.2 104.8,58.3 99.1,58.3 OJ9.1
OUT9  (via drill 0.3)
  Top 0.254: v120.3,33 120.6,32.7 121.7,32.7 VSLUE3.16 | v119.5,33.8 119.7,33.8 121,35.1 121.7,35.1 VSLUE3.18 | v124.2,36.8 128.8,36.8 128.9,36.9 173OUT9.1 129,37 129.1,37.1 135,37.1 OJ16.1
  Bottom 0.254: v119.5,33.8 v120.3,33 120.4,33 v124.2,36.8
OUT10  (via drill 0.3)
  Top 0.254: v120.4,28.2 121,27.6 121.7,27.6 VSLUE3.12 | v120.4,29.5 121.2,29.5 121.7,30 VSLUE3.14 | v124.2,28.2 127.8,28.2 128.9,27.1 169OUT10.1 128.9,27.2 135,27.2 OJ15.1
  Bottom 0.254: v120.4,29.5 v120.4,28.2 v124.2,28.2
OUT11
  Top 0.254: 109.3,27.5 105.4,27.5 105,27.1 167OUT11.1 105.1,27.3 99.1,27.3 OJ14.1 | 109.3,27.5 112.2,27.5 VSLUE3.9 | VSLUE3.7 112.2,30 111.7,30 109.3,27.6 109.3,27.5
OUT12
  Top 0.254: 111,34.3 111,33.5 111.8,32.7 112.2,32.7 VSLUE3.5 | 111,34.3 111.8,35.1 112.2,35.1 VSLUE3.3 | 111,34.3 109.7,34.3 106.9,37.1 105,37.1 164OUT12.1 104.9,37.2 104.8,37.3 99.1,37.3 OJ13.1
OUT13
  Top 0.254: VSLUE4.16 121.7,11.7 121.2,11.7 120.4,12.5 120.4,13.3 121.2,14.1 121.7,14.1 VSLUE4.18 121.8,14.2 125.3,14.2 127,15.9 128.9,15.9 161OUT13.1 129,16 129.1,16.1 135,16.1 OJ20.1
OUT14
  Top 0.254: VSLUE4.12 121.7,6.6 121.2,6.6 120.4,7.4 120.4,8.2 121.2,9 121.7,9 VSLUE4.14 121.8,9 124.1,9 127,6.1 128.9,6.1 159OUT14.1 128.9,6.2 135,6.2 OJ19.1
OUT15
  Top 0.254: VSLUE4.7 112.3,9 112.8,9 113.6,8.2 113.6,7.4 112.8,6.6 112.3,6.6 VSLUE4.9 112.2,6.5 105.4,6.5 105,6.1 147OUT15.1 105.1,6.3 99.1,6.3 OJ18.1
OUT16
  Top 0.254: VSLUE4.3 112.3,14.1 112.8,14.1 113.6,13.3 113.6,12.5 112.8,11.7 112.3,11.7 VSLUE4.5 112.2,11.7 111.3,11.7 106.9,16.1 105,16.1 145OUT16.1 104.9,16.2 104.8,16.3 99.1,16.3 OJ17.1

### Text on the board
tPlace: 5V | GND | 3.3V | GND | IO203 | IO201 | IO199 | IO197 | IO195 | IO189 | IO187 | IO185 | GND | 3.3V | 3.3V | GND | GND | 5V | 5V | GND